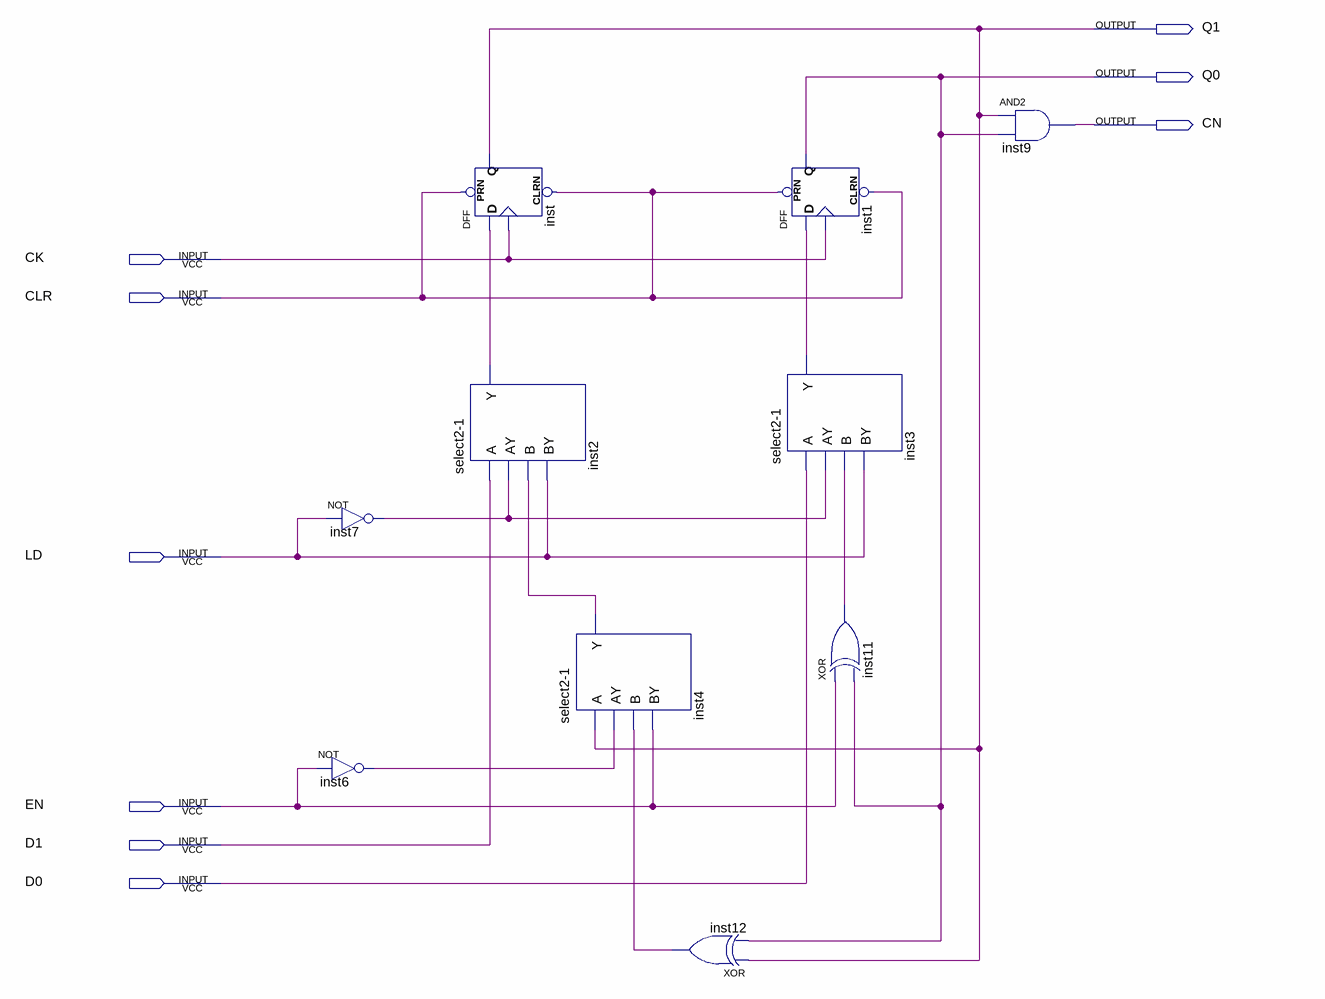
[diagram p0: schematic sheet]
// Quartus schematic count2.bdf as structural Verilog: 10 symbols, 9 pins
module count2 (
  input  CK,
  input  CLR,
  input  LD,
  input  EN,
  input  D1,
  input  D0,
  output Q1,
  output Q0,
  output CN
);

  wire inst2_y, inst3_y, inst4_y, inst6_out, inst7_out, inst11_out, inst12_out;

  not inst7 (inst7_out, LD);
  not inst6 (inst6_out, EN);
  DFF inst (.CLRN(CLR), .CLK(CK), .D(inst2_y), .PRN(CLR), .Q(Q1));
  \select2-1  inst2 (.A(D1), .AY(inst7_out), .B(inst4_y), .BY(LD), .Y(inst2_y));
  \select2-1  inst4 (.A(Q1), .AY(inst6_out), .B(inst12_out), .BY(EN), .Y(inst4_y));
  xor inst12 (inst12_out, Q1, Q0);
  DFF inst1 (.CLRN(CLR), .CLK(CK), .D(inst3_y), .PRN(CLR), .Q(Q0));
  \select2-1  inst3 (.A(D0), .AY(inst7_out), .B(inst11_out), .BY(LD), .Y(inst3_y));
  xor inst11 (inst11_out, EN, Q0);
  and inst9 (CN, Q1, Q0);
endmodule
